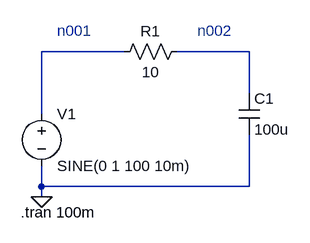
[diagram p0: schematic Yoneda-p64__Sine-wave_with-C=100u_+R=10_Freq=1000.asc]
Yoneda-p64__Sine-wave_with-C=100u_+R=10_Freq=1000.asc, the LTspice schematic file:
Version 4
SHEET 1 880 680
WIRE 224 0 96 0
WIRE 416 0 304 0
WIRE 416 64 416 0
WIRE 96 96 96 0
WIRE 96 208 96 176
WIRE 416 208 416 128
WIRE 416 208 96 208
WIRE 96 224 96 208
FLAG 96 224 0
SYMBOL voltage 96 80 R0
WINDOW 123 0 0 Left 2
WINDOW 39 0 0 Left 2
SYMATTR InstName V1
SYMATTR Value SINE(0 1 100 10m)
SYMBOL cap 400 64 R0
SYMATTR InstName C1
SYMATTR Value 100u
SYMBOL res 208 16 R270
WINDOW 0 32 56 VTop 2
WINDOW 3 0 56 VBottom 2
SYMATTR InstName R1
SYMATTR Value 10
TEXT 64 248 Left 2 !.tran 100m
TEXT 120 -32 Left 2 ;n001
TEXT 336 -32 Left 2 ;n002

The netlist it stands for:
* Yoneda-p64__Sine-wave_with-C=100u_+R=10_Freq=1000.asc
V1 N001 0 SINE(0 1 100 10m)
C1 N002 0 100u
R1 N001 N002 10
.tran 100m
* n001
* n002
.backanno
.end